# Altium project igbt_control_adapter.PrjPcb
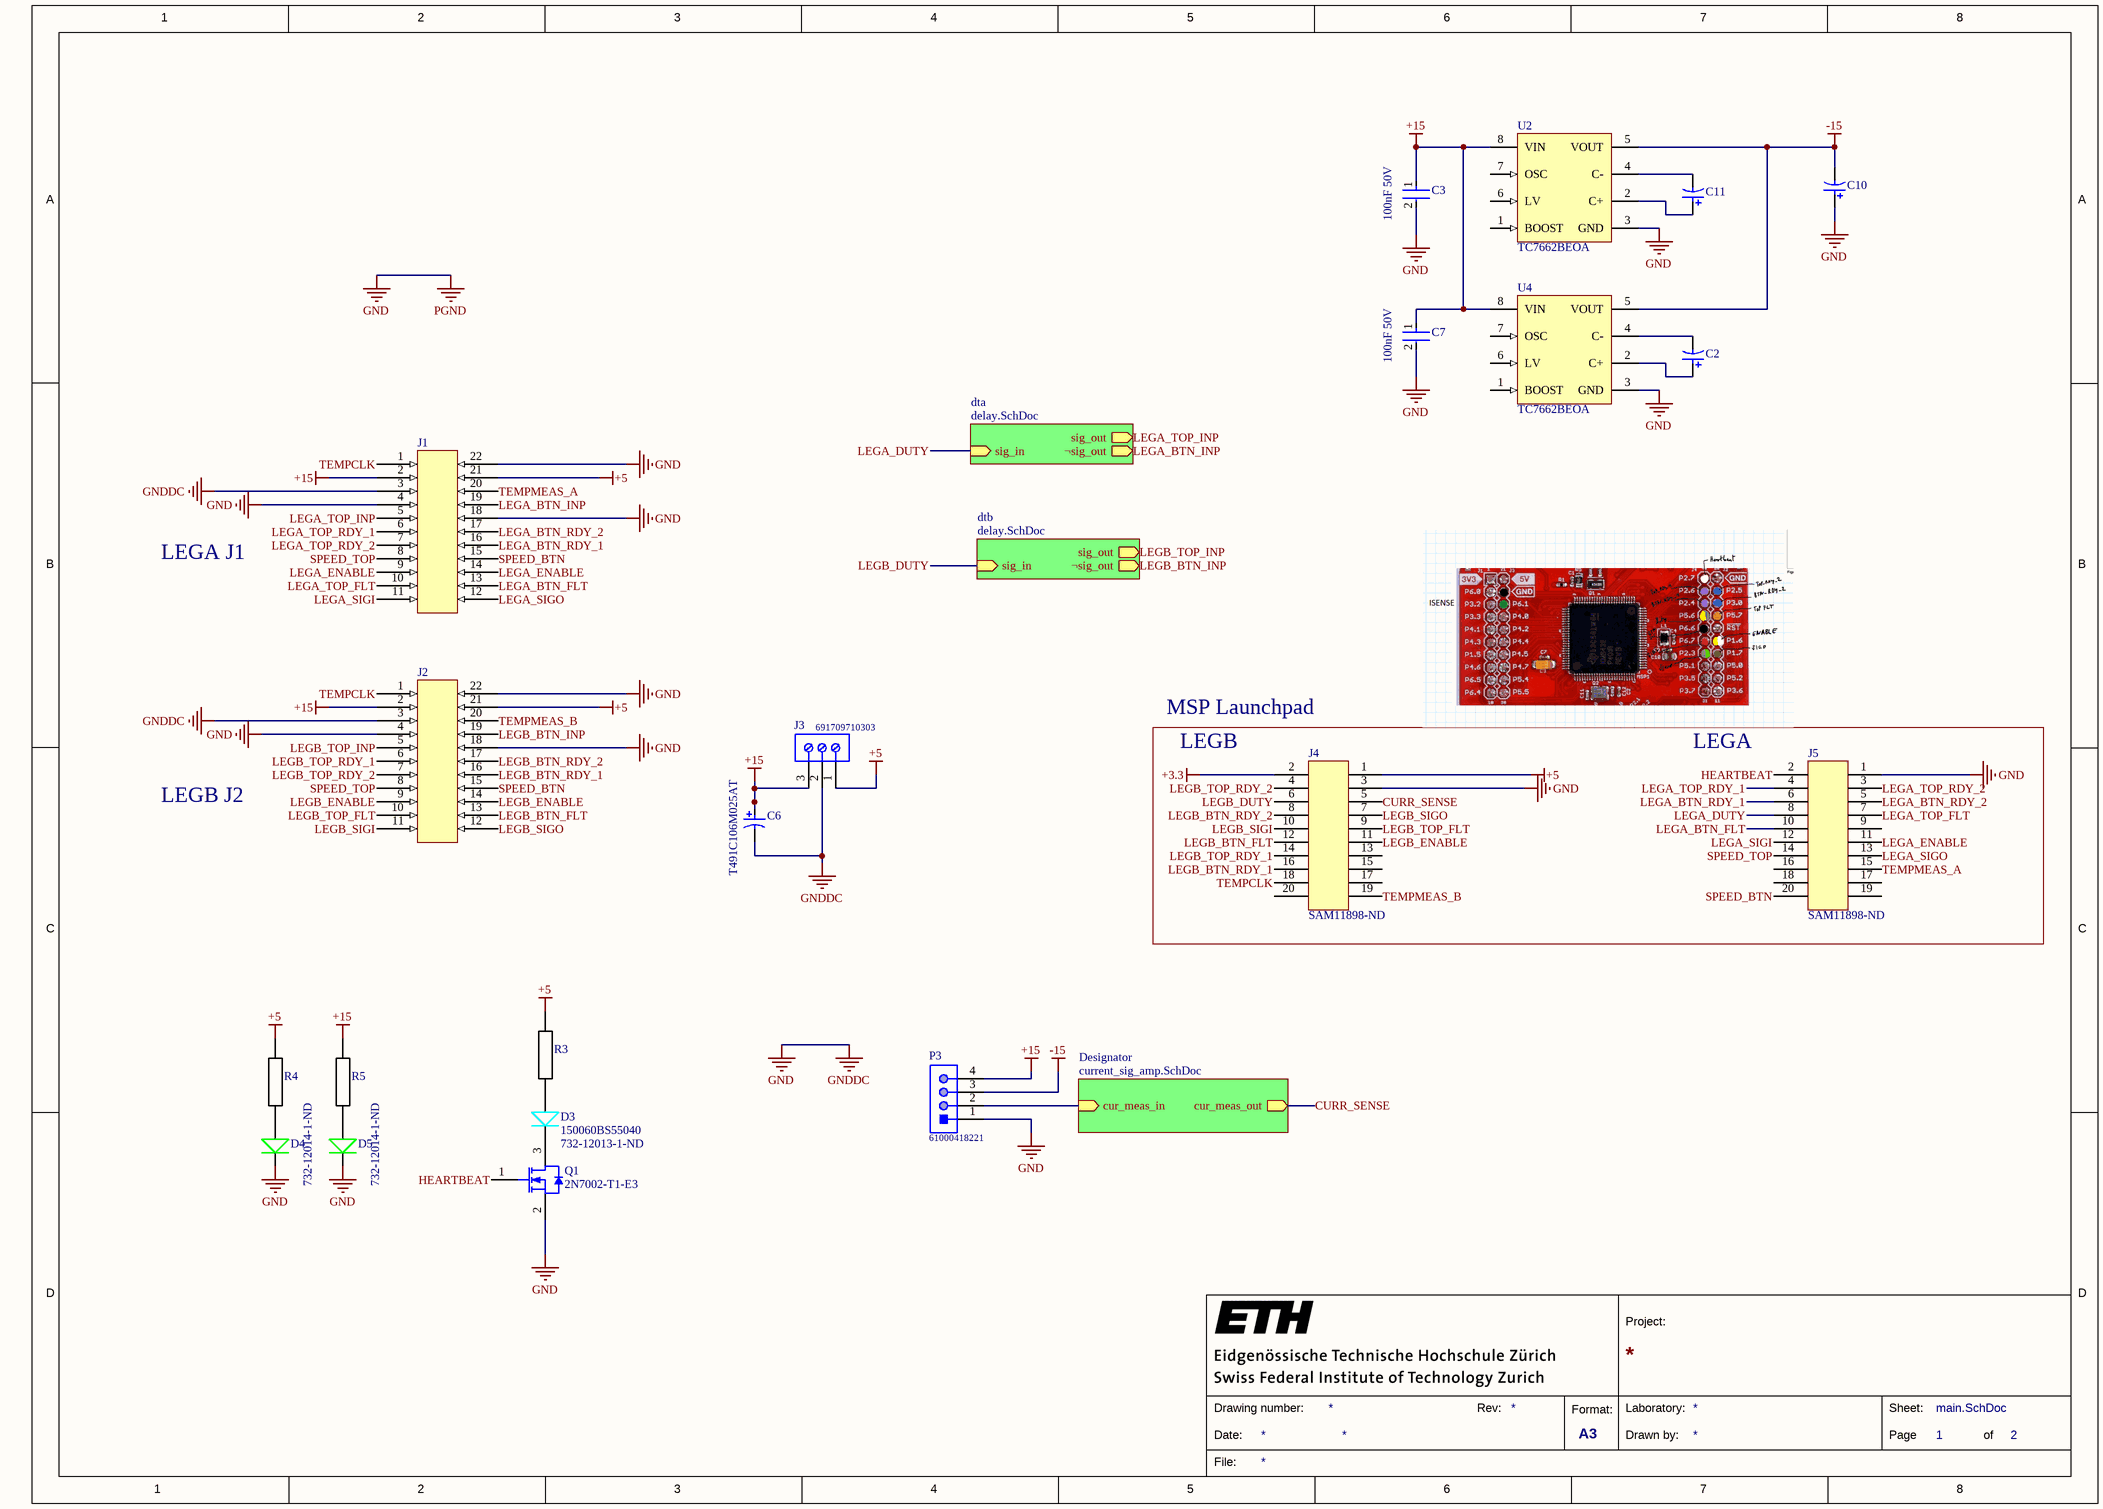
[diagram p0: main.SchDoc]
3 sheets, 45 parts. Net scope: hierarchical (ports join the sheet entries above them; power ports are global).
Board file: main.PcbDoc
Sheets:
  main.SchDoc
    dta = delay.SchDoc
    dtb = delay.SchDoc
    Designator = current_sig_amp.SchDoc

## Sheet main.SchDoc
size A3; SheetNumber: 1; SheetTotal: 2

### Parts
C2  TPSD226M025R0200  [AVX-7343-31_L]  (value not drawn)
C3  100nF 50V  [FP-CGA3E-0_3-0_1-IPC_A]
C6  T491C106M025AT  [KEMT-T491-C_L]
C7  100nF 50V  [FP-CGA3E-0_3-0_1-IPC_A]
C10  TPSD226M025R0200  [AVX-7343-31_L]  (value not drawn)
C11  TPSD226M025R0200  [AVX-7343-31_L]  (value not drawn)
D3  150060BS55040  Supplier Part Number 1: 732-12013-1-ND  [LED_BLUE_0603]
D4  732-12014-1-ND  [LED_GREEN_0603]
D5  732-12014-1-ND  [LED_GREEN_0603]
J1  header_22_milligrid  [header_22_milligrid]  (value not drawn)
J2  header_22_milligrid  [header_22_milligrid]  (value not drawn)
J3  691709710303  [691709710303]
J4  Supplier Part Number 1: SAM11898-ND  [header_f_20_imp]  (hidden comment: header_f_20_imp)
J5  Supplier Part Number 1: SAM11898-ND  [header_f_20_imp]  (hidden comment: header_f_20_imp)
P3  61000418221  [61000418221]
Q1  2N7002-T1-E3  [VISH-TO-236-3_A_L]
R3  res_smd  [0805]  (value not drawn)
R4  res_smd  [0805]  (value not drawn)
R5  res_smd  [0805]  (value not drawn)
U2  TC7662BEOA  [SOIC-OA8_M]
U4  TC7662BEOA  [SOIC-OA8_M]

### Sub-sheets
Designator = current_sig_amp.SchDoc: cur_meas_in (in), cur_meas_out (out)
dta = delay.SchDoc: sig_out (out), ¬sig_out (out), sig_in (in)
dtb = delay.SchDoc: sig_out (out), ¬sig_out (out), sig_in (in)

### Nets
+3.3: J4.2
+5: J1.21 J2.21 J3.1 J4.1 R3.1 R4.1
+15: C3.1 C6.1 C7.1 J1.2 J2.2 J3.3 P3.4 R5.1 U2.8(VIN) U4.8(VIN)
-15: C10.2 P3.3 U2.5(VOUT) U4.5(VOUT)
GND: C3.2 C6.2 C7.2 C10.1 D4.C D5.C J1.3 J1.4 J1.18 J1.22 J2.3 J2.4 J2.18 J2.22 J3.2 J4.3 J5.1 P3.1 Q1.2(S) U2.3(GND) U4.3(GND)  [also labelled GNDDC, PGND]
CURR_SENSE: J4.5 ; sheet Designator/cur_meas_out
HEARTBEAT: J5.2 Q1.1(G)
LEGA_BTN_FLT: J1.13 J5.10
LEGA_BTN_INP: J1.19 ; sheet dta/¬sig_out
LEGA_BTN_RDY_1: J1.16 J5.6
LEGA_BTN_RDY_2: J1.17 J5.5
LEGA_DUTY: J5.8 ; sheet dta/sig_in
LEGA_ENABLE: J1.9 J1.14 J5.11
LEGA_SIGI: J1.11 J5.12
LEGA_SIGO: J1.12 J5.13
LEGA_TOP_FLT: J1.10 J5.7
LEGA_TOP_INP: J1.5 ; sheet dta/sig_out
LEGA_TOP_RDY_1: J1.6 J5.4
LEGA_TOP_RDY_2: J1.7 J5.3
LEGB_BTN_FLT: J2.13 J4.12
LEGB_BTN_INP: J2.19 ; sheet dtb/¬sig_out
LEGB_BTN_RDY_1: J2.16 J4.16
LEGB_BTN_RDY_2: J2.17 J4.8
LEGB_DUTY: J4.6 ; sheet dtb/sig_in
LEGB_ENABLE: J2.9 J2.14 J4.11
LEGB_SIGI: J2.11 J4.10
LEGB_SIGO: J2.12 J4.7
LEGB_TOP_FLT: J2.10 J4.9
LEGB_TOP_INP: J2.5 ; sheet dtb/sig_out
LEGB_TOP_RDY_1: J2.6 J4.14
LEGB_TOP_RDY_2: J2.7 J4.4
SPEED_BTN: J1.15 J2.15 J5.20
SPEED_TOP: J1.8 J2.8 J5.14
TEMPCLK: J1.1 J2.1 J4.18
TEMPMEAS_A: J1.20 J5.15
TEMPMEAS_B: J2.20 J4.19
NetC2_1: C2.1 U4.2(C+)
NetC2_2: C2.2 U4.4(C-)
NetC11_1: C11.1 U2.2(C+)
NetC11_2: C11.2 U2.4(C-)
NetD3_A: D3.A R3.2
NetD3_C: D3.C Q1.3(D)
NetD4_A: D4.A R4.2
NetD5_A: D5.A R5.2
NetP3_2: P3.2 ; sheet Designator/cur_meas_in

Not connected (* = marked no-connect by the designer): J4 13 15 17 20; J5 9 16 17 18 19; U2 1(BOOST) 6(LV) 7(OSC); U4 1(BOOST) 6(LV) 7(OSC)

### Notes on the sheet
- LEGA J1
- MSP Launchpad
- LEGB
- LEGA
- LEGB J2
- 1
- 2
- 3
- 4
- 5
- 6
- 7
- 8
- A
- B
- C
- D
- Project:
- Date:
- Drawing number:
- Rev:
- Format:
- A3
- Drawn by:
- Laboratory:
- Page
- Sheet:
- of
- File:

### Library data of the parts
C2 C10 C11 = CMP-2000-07302-1: Tantalum Capacitor, 22 uF, +/- 20%, 25 V, -55 to 125 degC, 2-Pin SMD, RoHS, Tape and Reel; Manufacturer Size Code: D; Manufacturer: AVX; Other Names: 478-4106-6; Online Catalog: TPSSeries; ESR (Equivalent Series Resistance): 200mOhm; Voltage - Rated: 25V; Product Training Modules: ComponentSolutionsforSmartMeterApplications; Capacitance: 22µF; Featured Product: TPSCapacitors; Type: Molded; Package / Case: 2917(7343Metric); Size / Dimension: 0.287"Lx0.169"W(7.30mmx4.30mm); Standard Package: 1; Mounting Technology: SurfaceMount; Packaging: Digi-Reel®; Series: TPS; Category: Capacitors; Datasheet URL: https://datasheet.ciiva.com/11793/0900766b80066cb4-11793194.pdf; Tolerance: ±20%; Features: GeneralPurpose; Package Reference: 7343-31; Mounting Type: SurfaceMount; Operating Temperature: -55°C~125°C; Height - Seated (Max): 0.122"(3.10mm); Lead Spacing: -; Lifetime @ Temp.: -; Family: TantalumCapacitors; Manufacturer URL: http://www.avx.com/; Package Description: 2-Pin Surface Mount Device, Body 7.3 x 4.35 mm; Datasheet Version: 02/2004
C3 C7 = CMP-2000-07546-2: Cap Ceramic 100nF 50V X7R 10% Pad SMD 0603 +125°C Automotive T/R; Weight: 7.1E-05oz; Composition: Ceramic; Max Operating Temperature: 125°C; Termination: SMD/SMT; Dielectric: X7R; Length: 1.6mm; Package Quantity: 1; REACH SVHC: No SVHC; Lead Free: Lead Free; Case Code (Metric): 1608; Min Operating Temperature: -55°C; Packaging: Tape and Reel; Tolerance: 10%; Voltage Rating: 50V; Case Code (Imperial): 0603; Capacitance: 100nF; Case/Package: 0603; Voltage Rating (DC): 50V; Depth: 0.8mm; Radiation Hardening: No; Ratings: AEC-Q200; Mount: Surface Mount; Voltage: 50V; Thickness: 0.035inch; Width: 0.8mm; Height: 0.8mm
C6 = CMP-2000-07199-1: Tantalum Surface Mount Capacitor, 10 uF, +/- 20%, 25 V, -55 to 125 degC, 2-Pin SMD, RoHS, Tape and Reel; Manufacturer: Kemet; Product Diameter (mm): NotRequiredmm; Rad Hardened: No; Seal: NotRequired; Product Depth (mm): 3.2mm; ESR: 1.5ohm; Product Length (mm): 6mm; Voltage: 25VDC; DF: 6%; Product Height (mm): 2.5mm; Capacitance: 10000000pF; Polarity: Polar; Case Style: Molded; DCL: 2.5uA; Package Description: 2-Pin Surface Mount Device, Body 6 x 3.2 mm; Case Code: C; Length W/Weld: NotRequiredmm; Length W/Weld (max): NotRequiredmm; Manufacturer URL: http://www.kemet.com/; Mounting Style: SurfaceMount; Tolerance (+ or -): 20%; Failure Rate: NotRequired; Package / Case: 6032-28; Seated Plane Height: NotRequiredmm; Construction: SMTChip; Operating Temp Range: -55Cto125C; Mounting Technology: SurfaceMount; Lead Spacing (nom): NotRequiredmm; Wire Form: NotRequired; Insulation: NotRequired; Datasheet Version: 06/2016; Package Reference: T491-C; Packaging: TapeandReel; Datasheet URL: http://www.kemet.com/Lists/ProductCatalog/Attachments/254/KEM_T2005_T491.pdf
D3 = led_blue_0603: Supplier 1: Digi-Key
D4 D5 = led_green_0603: Supplier 1: Digi-Key; Supplier Part Number 1: 732-12014-1-ND
J3 = CMP-1502-03336-1: Serie 7097 - 5.00 mm Horizontal Entry SMT with Pressure Clamp WR-TBL, 3 pin; Manufacturer: Wurth Elektronik; Pitch: 5.00mm; Pin Number: 3; Mounting Technology: SMT; Publisher: WurthElektronik; Package Reference: 691709710303; Packaging: TapeandReelwithCap; Part Number: 691709710303; Operating Temperature: -45to130degC; Datasheet URL: http://katalog.we-online.de/em/datasheet/6917097103xx.pdf; Manufacturer URL: http://www.we-online.de
P3 = CMP-1502-01019-1: SMT Vertical Pin Header WR-PHD, Pitch 2.54 mm, Single Row, 4 pins; Manufacturer: Wurth Elektronik; Rated Current: 3A; Gender: Male; Withstanding Voltage: 500VAC; Working Voltage: 250VAC; Pitch: 2.54mm; Pin Number: 4; Contact Resistance: 20mOhm; Mounting Technology: SMT; Packaging: Tube; Manufacturer URL: http://www.we-online.de; Row Number: Single; Operating Temperature: -40to125degC; Part Number: 61000418221; Publisher: WurthElektronik; Orientation: Vertical; Package Reference: 61000418221; Datasheet URL: https://katalog.we-online.de/em/datasheet/6100xx18221.pdf
Q1 = CMP-2000-05565-1: N-Channel MOSFET, 115 mA, 60 V, -55 to 150 degC, 3-Pin SOT23, RoHS, Tape and Reel; Manufacturer: Vishay; Continuous Drain Current Id: 115mA; Threshold Voltage Vgs: 2.1V; Transistor Case Style: TO-236; On Resistance Rds(on): 7.5ohm; Transistor Polarity: NChannel; Power Dissipation Pd: 200mW; No. of Pins: 3; SVHC: NoSVHC(17-Dec-2014); Drain Source Voltage Vds: 60V; Rds(on) Test Voltage Vgs: 10V; Package URL: http://www.vishay.com/docs/71196/71196.pdf; Package Description: 3-Pin Small Outline Transistor, Body 2.92 x 1.3 mm, Pitch 0.95 mm; Datasheet URL: http://www.vishay.com/docs/70226/70226.pdf; Package Reference: TO-236-3; MSL: MSL1-Unlimited; Mounting Technology: SurfaceMount; Operating Temperature Max: 150°C; Datasheet Version: Rev. F, 07/2001; Manufacturer URL: http://www.vishay.com/
U2 U4 = CMP-0132-00036-1: Charge Pump DC-to-DC Voltage Converter, 10kHz, 35kHz, 8-Pin SOIC 150mil, Industrial Temperature; PackageReference: SOIC-OA8; Code_IPC: SOIC127P600-8; PackageDescription: 8-Lead Plastic Small Outline (OA) - Narrow, 3.90mm Body [SOIC]; PackageVersion: revBB, Aug-2009; DatasheetVersion: revA, Oct-2002
J1 J2 = header_22_milligrid: Supplier 1: Digi-Key; Supplier Part Number 1: 23-0877592250-ND
J4 J5 = header_f_20_imp: Supplier 1: Digi-Key

## Sheet delay.SchDoc
size A3; SheetNumber: 2; SheetTotal: 2
Used 2 times, as channels dta, dtb. Parts and nets are listed once, with the designators drawn on the sheet.
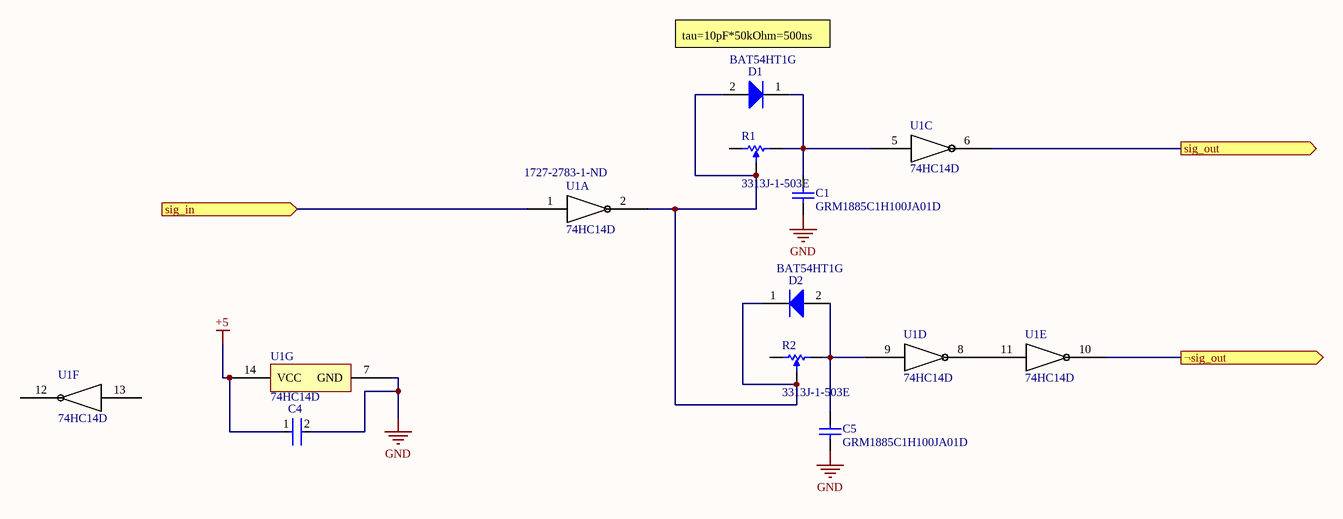
[diagram p1: delay.SchDoc]

### Parts
C1  GRM1885C1H100JA01D  [CAPC1608X90X35LL10T15]
C4  C0603X104K5RACTU  [FP-C0603-CJ-MFG]  (value not drawn)
C5  GRM1885C1H100JA01D  [CAPC1608X90X35LL10T15]
D1  BAT54HT1G  [ONSC-SOD-323-2-477-02_V]
D2  BAT54HT1G  [ONSC-SOD-323-2-477-02_V]
R1  3313J-1-503E  [BOUR-3313J-1_V]
R2  3313J-1-503E  [BOUR-3313J-1_V]
U1  74HC14D  Supplier Part Number 1: 1727-2783-1-ND  [SOP14_narrow]  (parts A,C,D,E,F,G of 7)

### Ports
sig_in (in), sig_out (out), ¬sig_out (out)

### Nets
+5: C4.1 U1.14(VCC)
GND: C1.1 C4.2 C5.1 U1.7(GND)
sig_in: U1.1(1A) ; port sig_in
sig_out: U1.6(3Y) ; port sig_out
¬sig_out: U1.10(5Y) ; port ¬sig_out
NetC1_2: C1.2 D1.1(K) R1.3 U1.5(3A)
NetC5_2: C5.2 D2.2(A) R2.3 U1.9(4A)
NetD1_2: D1.2(A) D2.1(K) R1.2 R2.2 U1.2(1Y)
NetU1_8: U1.8(4Y) U1.11(5A)

Not connected (* = marked no-connect by the designer): R1 1; R2 1; U1 12(6Y) 13(6A)

### Channels
dta: designators end in _dta; ports sig_in=LEGA_DUTY sig_out=LEGA_TOP_INP ¬sig_out=LEGA_BTN_INP
dtb: designators end in _dtb; ports sig_in=LEGB_DUTY sig_out=LEGB_TOP_INP ¬sig_out=LEGB_BTN_INP

### Notes on the sheet
- (near D1) tau=10pF*50kOhm=500ns
- 1
- 2
- 3
- 4
- 5
- 6
- 7
- 8
- A
- B
- C
- D
- Project:
- Date:
- Drawing number:
- Rev:
- Format:
- A3
- Drawn by:
- Laboratory:
- Page
- Sheet:
- of
- File:

### Library data of the parts
C1 C5 = CMP-2006-02592-1: Manufacturer: Murata; Part Number: GRM1885C1H100JA01D
C4 = CMP-2006-03300-2: CAP CER 0.1UF 50V X7R 0603; Manufacturer: Kemet; Capacitance: 100nF; Material: Ceramic; Tolerance: 10%; Value: 100nF; Temperature Coefficient: 15%; Temperature Range High: +125°C; Temperature Range Low: -55°C; Manufacturer Part Number: C0603X104K5RACTU; Voltage: 50V; ComponentLink2Description: Datasheet; RoHS: TRUE; ComponentLink2URL: https://content.kemet.com/datasheets/KEM_C1013_X7R_FT-CAP_SMD.pdf; Device Class L3: Ceramic Capacitors; Device Class L2: Capacitors; Package: C0603-CJ; Height: 0.95mm; Device Class L1: Passive Components; Temperature Characteristic: X7R; Lead Free: Yes; Digikey Description: CAP CER 0.1UF 50V X7R 0603; Automotive: No; Mouser Description: Capacitor; Ceramic; Cap 0.1uF; Tol+10%; SMT; Flexible Termination; Vol-Rtg 50V; TR; Temperature: -55°C to +125°C; Octopart: https://octopart.com/c0603x104k5ractu-kemet-9145062; Category: Cap; Voltage Rating: 50V; Ipc Land Pattern Name: CAPC16080X80
D1 D2 = CMP-1055-00462-1: Schottky Barrier Diode, 2-Pin SOD-323, Pb-Free, Tape and Reel; Manufacturer: On Semiconductor; Configuration: Single; trr Max (ns): 5; IFSM Max (A): 0.6; ComponentLink3URL: http://www.onsemi.com/pub_link/Collateral/477-02.PDF.1; PackageDescription: 2-Pin SOD, Body 1.7 x 1.25 mm; ComponentLink2URL: http://www.onsemi.cn/pub_link/Collateral/BAT54HT1-D.PDF; ComponentLink3Description: Package Specification; ComponentLink2Description: Datasheet; DatasheetVersion: Rev. 6; PackageReference: SOD-323-2-477-02; RoHS: TRUE; ComponentLink1URL: http://www.onsemi.com/; Packing: Tape and Reel; PartNumber: BAT54HT1G; Mounting Technology: Surface Mount; ComponentLink1Description: Manufacturer URL; PackageVersion: Rev. H, 03/2007
R1 R2 = CMP-2000-05588-1: 3 mm Trimpot(R) Trimming Potentiometer, 50 KOhm, +/- 20%, 0.125 W, -55 to 125 degC, 3-Pin SMD, RoHS, Tape and Reel; Manufacturer: Bourns; SVHC: NoSVHC(19-Dec-2012); Temperature Coefficient: ±150ppm/°C; No. of Turns: 1; Power Rating: 125mW; Track Resistance: 50kohm; Manufacturer URL: http://www.bourns.com/; Potentiometer Mounting: SMD; Package Description: 3-Pin Surface Mount Device, Body 3.5 x 3.2 mm, Pitch 1.15 mm; Package Reference: 3313J-1; Mounting Technology: SurfaceMount; Resistance Tolerance: ±20%; Datasheet Version: 05/2016; Datasheet URL: http://www.bourns.com/docs/Product-Datasheets/3313.pdf
U1 = 74HC14D: Supplier 1: Digi-Key

## Sheet current_sig_amp.SchDoc
size 210 x 148 mm
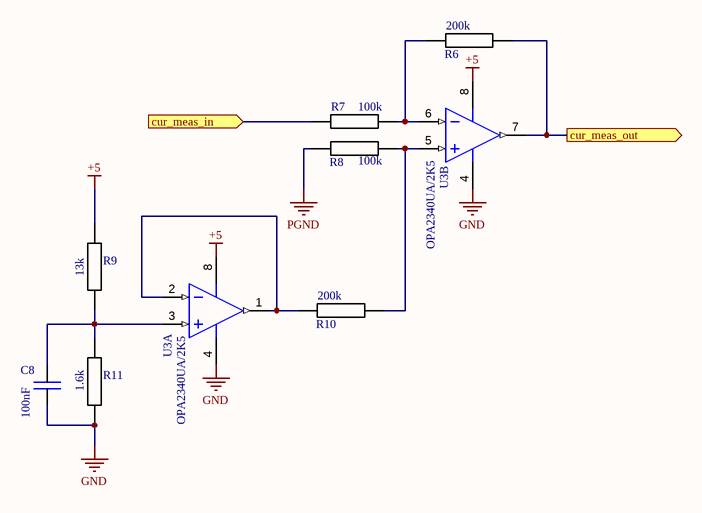
[diagram p2: current_sig_amp.SchDoc]

### Parts
C8  100nF  [0805]
R6  200k  [0805]
R7  100k  [0805]
R8  100k  [0805]
R9  13k  [0805]
R10  200k  [0805]
R11  1.6k  [0805]
U3  OPA2340UA/2K5  [D0008A_M]  (parts A,B of 2)

### Ports
cur_meas_in (in), cur_meas_out (out)

### Nets
+5: R9.1 U3.8(V+)
GND: C8.2 R8.1 R11.2 U3.4(V-)  [also labelled PGND]
CURR_SENSE: R6.2 U3.7(OUT_B) ; port cur_meas_out
NetC8_1: C8.1 R9.2 R11.1 U3.3(IN_A+)
NetP3_2: R7.1 ; port cur_meas_in
NetR6_1: R6.1 R7.2 U3.6(IN_B-)
NetR8_2: R8.2 R10.2 U3.5(IN_B+)
NetR10_1: R10.1 U3.1(OUT_A) U3.2(IN_A-)

### Notes on the sheet
- Project:
- File:
- Date:
- Drawing number:
- Rev:
- Format:
- A5
- Drawn by:
- Laboratory:
- Page
- Sheet:
- of

### Library data of the parts
C8 = cap_smd
R6-R11 = res_smd
U3 = CMP-0272-00789-3: Single-Supply, Rail-to-Rail Operational Amplifier MicroAmplifier(TM) Series, 2.5 to 5.5 V, -40 to 85 degC, 8-pin SOIC (D8), Green (RoHS & no Sb/Br); Manufacturer: Texas Instruments; Sub Family: Low Input Bias Current Amp (<=10pA), Low Offset Voltage Amplifier (<=500uV), Low Supply Voltage Amplifier (<=2.7V), Precision Amplifier; Offset Drift(Typ)(uV/C): 2.5; CMRR(Min)(dB): 80; Vn at 1kHz(Typ)(nV/rtHz): 25; Vio (25C)(Max)(mV): 0.5; Number of Channels: 2; Iq per channel(Max)(mA): 0.95; Slew Rate(Typ)(V/us): 6; Total Supply Voltage(Max)(+5V is 5, +/-5V is 10): 5.5; IIB(Max)(pA): 10; Eco-Plan: Green (RoHS & no Sb/Br); ComponentLink3URL: http://www.ti.com/litv/pdf/msoi002j; PartNumber: OPA2340UA/2K5; PackageReference: D0008A; ComponentLink2URL: http://www.ti.com/general/docs/lit/getliterature.tsp?genericPartNumber=OPA2340&fileType=pdf; Code_JEDEC: MS-012; DatasheetVersion: SBOS073B; ComponentLink1URL: http://www.ti.com/; ComponentLink3Description: Package Specification; ComponentLink2Description: Datasheet; PackageVersion: 4040047-3/M, 06/2011; Mounting Technology: Surface Mount; PackageDescription: 8-Pin Plastic Small Outline, Body 4.9 x 3.9 mm, Pitch 1.27 mm; Total Supply Voltage(Min)(+5V is 5, +/-5V is 10): 2.5; ComponentLink1Description: Manufacturer URL

## Nets that join several sheets
+5: main (6 pins), dta (C4_dta.1 U1_dta.14), dtb (C4_dtb.1 U1_dtb.14), current_sig_amp (R9.1 U3.8)
GND: main (21 pins), dta (C1_dta.1 C4_dta.2 C5_dta.1 U1_dta.7), dtb (C1_dtb.1 C4_dtb.2 C5_dtb.1 U1_dtb.7), current_sig_amp (C8.2 R8.1 R11.2 U3.4)
CURR_SENSE: main (J4.5), current_sig_amp (R6.2 U3.7)
LEGA_BTN_INP: main (J1.19), dta (U1_dta.10)
LEGA_DUTY: main (J5.8), dta (U1_dta.1)
LEGA_TOP_INP: main (J1.5), dta (U1_dta.6)
LEGB_BTN_INP: main (J2.19), dtb (U1_dtb.10)
LEGB_DUTY: main (J4.6), dtb (U1_dtb.1)
LEGB_TOP_INP: main (J2.5), dtb (U1_dtb.6)
NetP3_2: main (P3.2), current_sig_amp (R7.1)